# Altium project master_pcb.PrjPcb
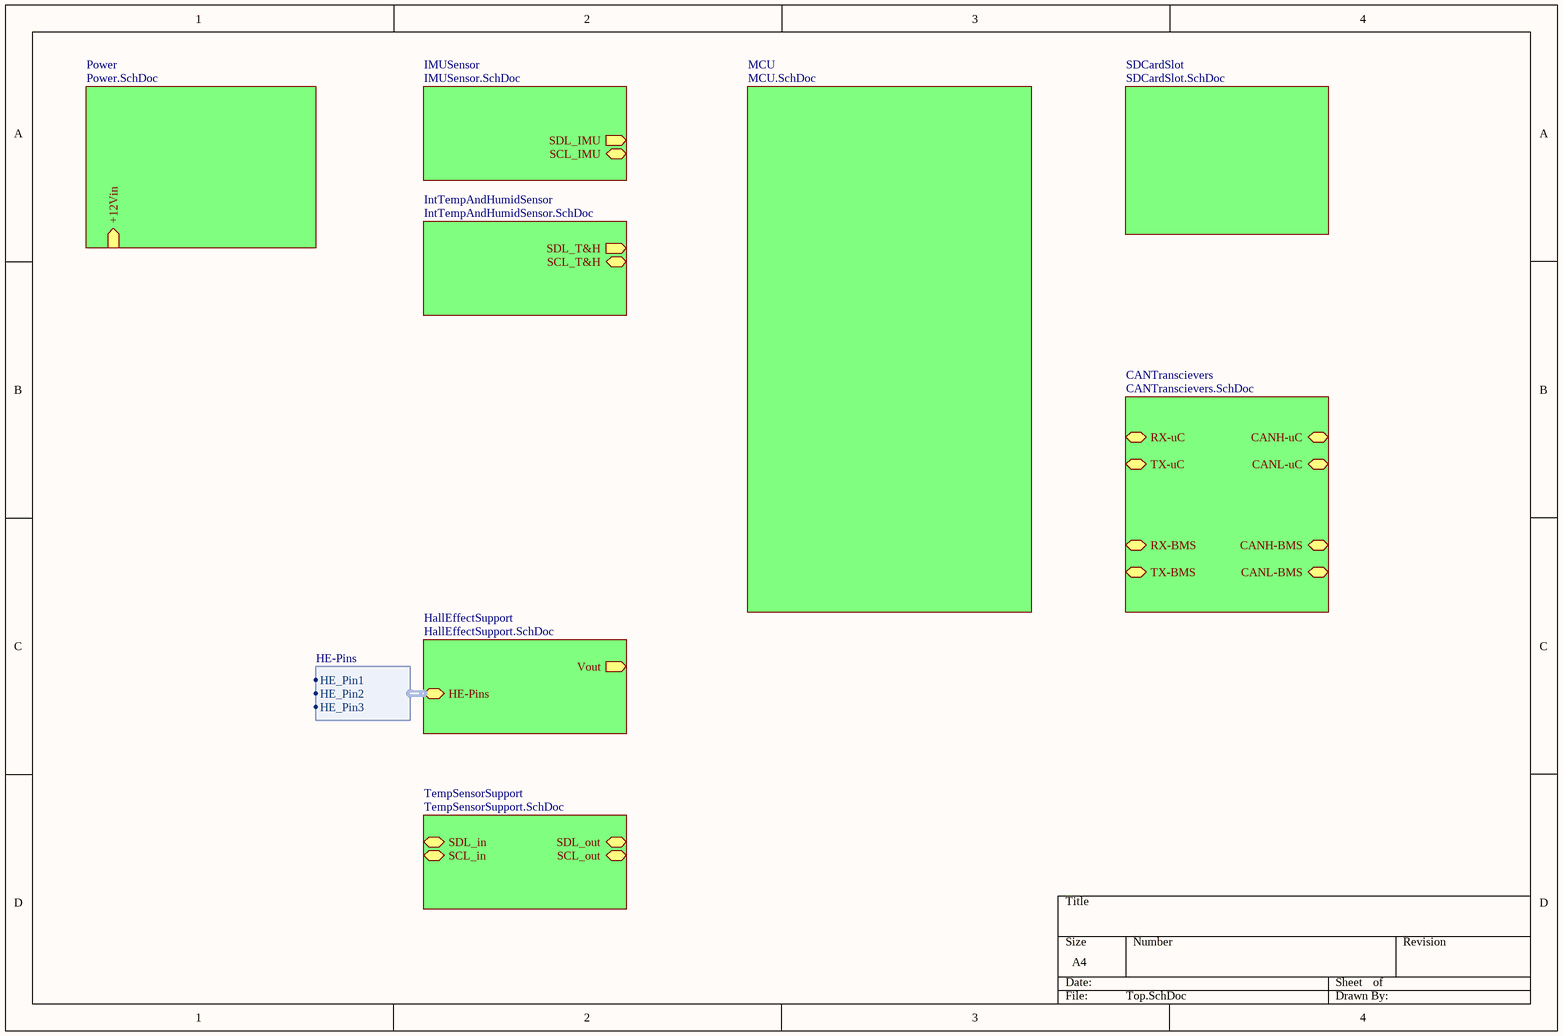
[diagram p0: Top.SchDoc]
9 sheets, 2 parts. Net scope: hierarchical (ports join the sheet entries above them; power ports are global).
Sheets:
  Top.SchDoc
    Power = Power.SchDoc
    IMUSensor = IMUSensor.SchDoc
    SDCardSlot = SDCardSlot.SchDoc
    TempSensorSupport = TempSensorSupport.SchDoc
    CANTranscievers = CANTranscievers.SchDoc
    MCU = MCU.SchDoc
    IntTempAndHumidSensor = IntTempAndHumidSensor.SchDoc
    HallEffectSupport = HallEffectSupport.SchDoc

## Sheet Top.SchDoc
size A4

### Sub-sheets
CANTranscievers = CANTranscievers.SchDoc: RX-BMS, TX-BMS, RX-uC, TX-uC, CANH-uC, CANL-uC, CANH-BMS, CANL-BMS
HallEffectSupport = HallEffectSupport.SchDoc: HE-Pins (harness HE-Pins), Vout (out)
IMUSensor = IMUSensor.SchDoc: SDL_IMU (out), SCL_IMU
IntTempAndHumidSensor = IntTempAndHumidSensor.SchDoc: SDL_T&H (out), SCL_T&H
MCU = MCU.SchDoc: no entries
Power = Power.SchDoc: +12Vin (in)
SDCardSlot = SDCardSlot.SchDoc: no entries
TempSensorSupport = TempSensorSupport.SchDoc: SDL_in, SCL_in, SDL_out, SCL_out

### Harnesses
HE-Pins: HE_Pin1, HE_Pin2, HE_Pin3

### Nets
NetR?_1: sheet HallEffectSupport/Vout, sheet HallEffectSupport/HE-Pins.HE_Pin2

## Sheet Power.SchDoc
size A4
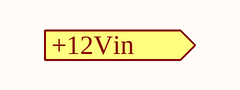
[diagram p1: Power.SchDoc]

### Ports
+12Vin (in)

## Sheet IMUSensor.SchDoc
size A4
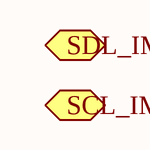
[diagram p2: IMUSensor.SchDoc]

### Ports
SCL_IMU, SDL_IMU (out)

## Sheet SDCardSlot.SchDoc
size A4

## Sheet TempSensorSupport.SchDoc
size A4
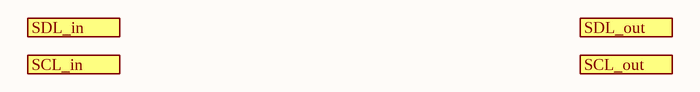
[diagram p3: TempSensorSupport.SchDoc]

### Ports
SCL_in, SCL_out, SDL_in, SDL_out

## Sheet CANTranscievers.SchDoc
size A4
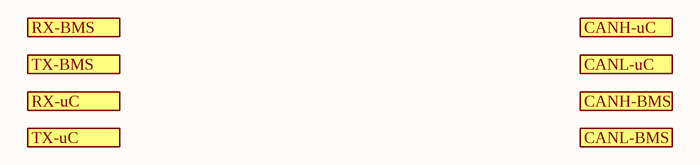
[diagram p4: CANTranscievers.SchDoc]

### Ports
CANH-BMS, CANH-uC, CANL-BMS, CANL-uC, RX-BMS, RX-uC, TX-BMS, TX-uC

## Sheet MCU.SchDoc
size A4

## Sheet IntTempAndHumidSensor.SchDoc
size A4
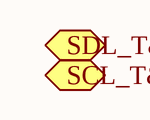
[diagram p5: IntTempAndHumidSensor.SchDoc]

### Ports
SCL_T&H, SDL_T&H (out)

## Sheet HallEffectSupport.SchDoc
size A4
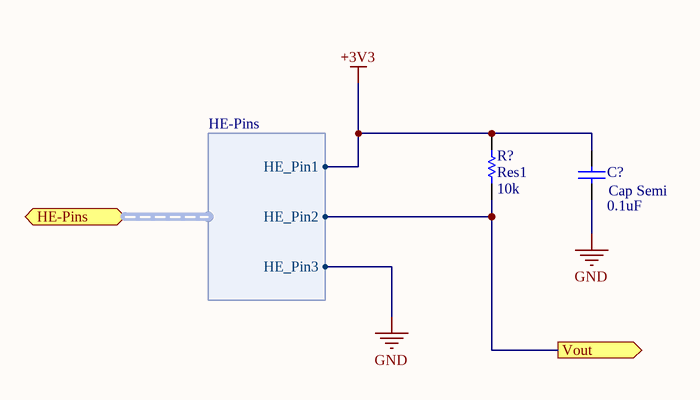
[diagram p6: HallEffectSupport.SchDoc]

### Parts
C?  Cap Semi  value 0.1uF  [C1206]
R?  Res1  value 10k  [AXIAL-0.3]

### Ports
HE-Pins (harness HE-Pins), Vout (out)

### Harnesses
HE-Pins: HE_Pin1, HE_Pin2, HE_Pin3

### Nets
+3V3: C?.2 R?.2 ; port HE-Pins.HE_Pin1
GND: C?.1 ; port HE-Pins.HE_Pin3
NetR?_1: R?.1 ; port Vout, port HE-Pins.HE_Pin2

### Library data of the parts
C? = Cap Semi: Capacitor (Semiconductor SIM Model); Published: 8-Jun-2000; LatestRevisionDate: 29-May-2009; LatestRevisionNote: IPC-7351 Footprint Added.; PackageReference: C1206; Publisher: Altium Limited; PackageDescription: Chip Capacitor
R? = Res1: Resistor; Published: 8-Jun-2000; LatestRevisionDate: 17-Jul-2002; LatestRevisionNote: Re-released for DXP Platform.; PackageReference: AXIAL-0.3; Publisher: Altium Limited; PackageDescription: Axial Device, Thru-Hole; 2 Leads; 0.3 in Pin Spacing